# Altium schematic sheet VLP_FPC.SchDoc
size A4
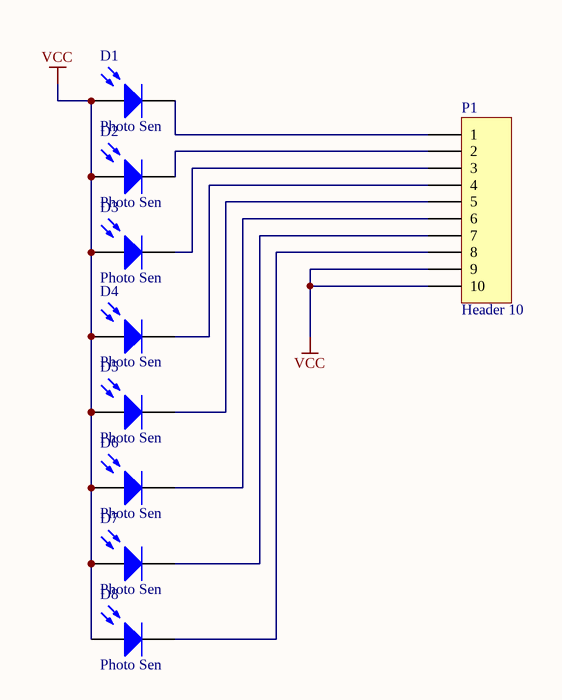
[diagram p0: VLP_FPC.SchDoc]

## Parts
D1  Photo Sen  [1206C]
D2  Photo Sen  [1206C]
D3  Photo Sen  [1206C]
D4  Photo Sen  [1206C]
D5  Photo Sen  [1206C]
D6  Photo Sen  [1206C]
D7  Photo Sen  [1206C]
D8  Photo Sen  [1206C]
P1  Header 10  [FPC-10P]

## Nets
VCC: D1.1(A) D2.1(A) D3.1(A) D4.1(A) D5.1(A) D6.1(A) D7.1(A) D8.1(A) P1.9 P1.10
NetD1_2: D1.2(K) P1.1
NetD2_2: D2.2(K) P1.2
NetD3_2: D3.2(K) P1.3
NetD4_2: D4.2(K) P1.4
NetD5_2: D5.2(K) P1.5
NetD6_2: D6.2(K) P1.6
NetD7_2: D7.2(K) P1.7
NetD8_2: D8.2(K) P1.8

## Library data of the parts
D1-D8 = Photo Sen: Photosensitive Diode; Published: 24-Mar-1999; LatestRevisionDate: 17-Jul-2002; LatestRevisionNote: Re-released for DXP Platform.; PackageReference: PIN2; Publisher: Altium Limited
P1 = Header 10: Header, 10-Pin; LatestRevisionDate: 17-Jul-2002; LatestRevisionNote: Re-released for DXP Platform.; Publisher: Altium Limited